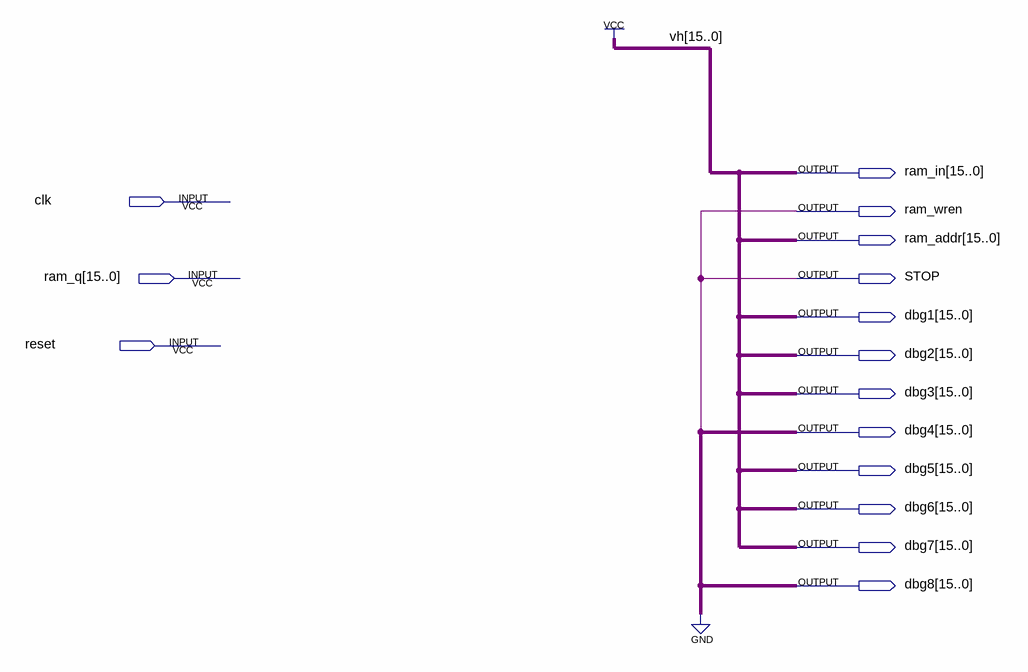
[diagram p0: schematic sheet]
// Quartus schematic cpu.bdf as structural Verilog: 0 symbols, 15 pins
module cpu (
  input  clk,
  input  [15:0] ram_q,
  input  reset,
  output [15:0] ram_in,
  output ram_wren,
  output [15:0] ram_addr,
  output STOP,
  output [15:0] dbg1,
  output [15:0] dbg2,
  output [15:0] dbg3,
  output [15:0] dbg4,
  output [15:0] dbg5,
  output [15:0] dbg6,
  output [15:0] dbg7,
  output [15:0] dbg8
);


  assign dbg1 = {16{1'b1}};
  assign dbg2 = {16{1'b1}};
  assign dbg3 = {16{1'b1}};
  assign dbg4 = {16{1'b0}};
  assign dbg5 = {16{1'b1}};
  assign dbg6 = {16{1'b1}};
  assign dbg7 = {16{1'b1}};
  assign dbg8 = {16{1'b0}};
  assign ram_addr = {16{1'b1}};
  assign ram_in = {16{1'b1}};
  assign STOP = ram_wren;
endmodule
